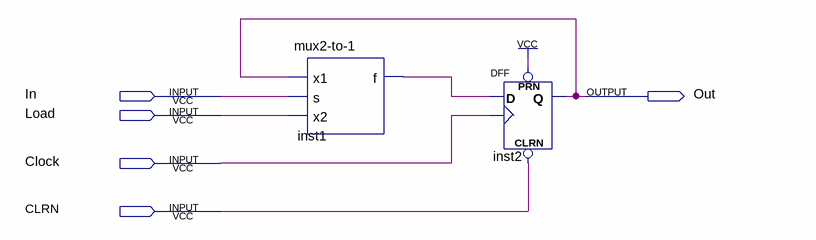
[diagram p0: schematic sheet]
// Quartus schematic register.bdf as structural Verilog: 2 symbols, 5 pins
module register (
  input  In,
  input  Load,
  input  Clock,
  input  CLRN,
  output Out
);

  wire inst1_f;

  \mux2-to-1  inst1 (.x1(Out), .s(In), .x2(Load), .f(inst1_f));
  DFF inst2 (.CLRN(CLRN), .CLK(Clock), .D(inst1_f), .PRN(1'b1), .Q(Out));
endmodule
